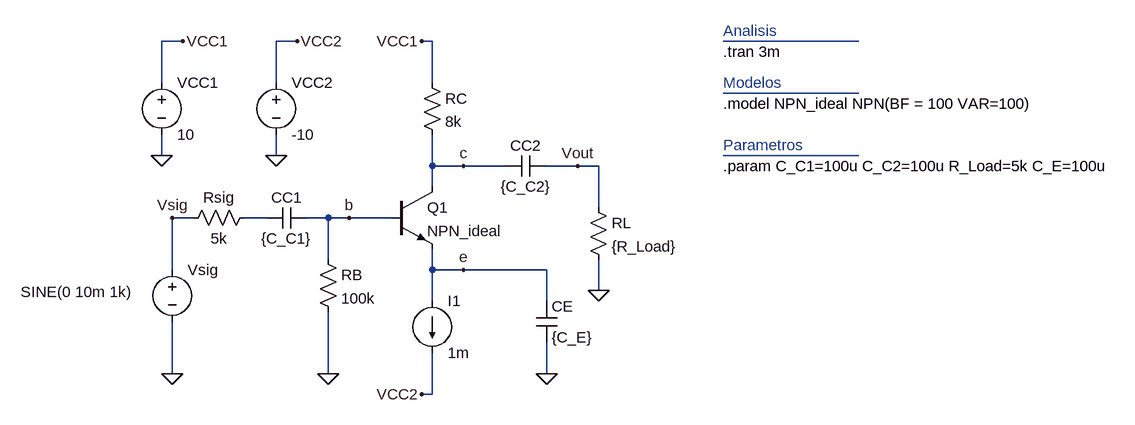
[diagram p0: schematic bjt_ce_time.asc]
bjt_ce_time.asc, the LTspice schematic file:
Version 4
SHEET 1 916 680
WIRE -560 -256 -592 -256
WIRE -384 -256 -416 -256
WIRE -176 -256 -192 -256
WIRE 480 -256 272 -256
WIRE -592 -192 -592 -256
WIRE -416 -192 -416 -256
WIRE -176 -192 -176 -256
WIRE 480 -176 272 -176
WIRE -592 -80 -592 -112
WIRE -416 -80 -416 -112
WIRE 480 -80 272 -80
WIRE -176 -64 -176 -112
WIRE -128 -64 -176 -64
WIRE -64 -64 -128 -64
WIRE 48 -64 0 -64
WIRE 80 -64 48 -64
WIRE -176 -32 -176 -64
WIRE 80 0 80 -64
WIRE -544 16 -576 16
WIRE -432 16 -464 16
WIRE -336 16 -368 16
WIRE -304 16 -336 16
WIRE -240 16 -304 16
WIRE -336 80 -336 16
WIRE -576 96 -576 16
WIRE -176 96 -176 64
WIRE -128 96 -176 96
WIRE 0 96 -128 96
WIRE 80 128 80 80
WIRE -176 144 -176 96
WIRE 0 144 0 96
WIRE -576 256 -576 176
WIRE -336 256 -336 160
WIRE 0 256 0 208
WIRE -176 288 -176 224
WIRE -176 288 -192 288
FLAG -592 -80 0
FLAG -560 -256 VCC1
FLAG -576 256 0
FLAG -192 -256 VCC1
FLAG 48 -64 Vout
FLAG -192 288 VCC2
FLAG 0 256 0
FLAG -336 256 0
FLAG -416 -80 0
FLAG -384 -256 VCC2
FLAG 80 128 0
FLAG -576 16 Vsig
FLAG -304 16 b
FLAG -128 -64 c
FLAG -128 96 e
SYMBOL npn -240 -32 R0
SYMATTR InstName Q1
SYMATTR Value NPN_ideal
SYMBOL res -352 64 R0
SYMATTR InstName RB
SYMATTR Value 100k
SYMBOL res -192 -208 R0
SYMATTR InstName RC
SYMATTR Value 8k
SYMBOL voltage -592 -208 R0
WINDOW 123 0 0 Left 0
WINDOW 39 0 0 Left 0
SYMATTR InstName VCC1
SYMATTR Value 10
SYMBOL voltage -576 80 R0
WINDOW 3 -233 50 Left 2
WINDOW 123 0 0 Left 0
WINDOW 39 0 0 Left 0
SYMATTR Value SINE(0 10m 1k)
SYMATTR InstName Vsig
SYMBOL current -176 144 R0
WINDOW 123 0 0 Left 0
WINDOW 39 0 0 Left 0
SYMATTR InstName I1
SYMATTR Value 1m
SYMBOL cap -368 0 R90
WINDOW 0 0 32 VBottom 2
WINDOW 3 32 32 VTop 2
SYMATTR InstName CC1
SYMATTR Value {C_C1}
SYMBOL cap -16 144 R0
SYMATTR InstName CE
SYMATTR Value {C_E}
SYMBOL cap 0 -80 R90
WINDOW 0 0 32 VBottom 2
WINDOW 3 32 32 VTop 2
SYMATTR InstName CC2
SYMATTR Value {C_C2}
SYMBOL res -448 0 R90
WINDOW 0 0 56 VBottom 2
WINDOW 3 32 56 VTop 2
SYMATTR InstName Rsig
SYMATTR Value 5k
SYMBOL voltage -416 -208 R0
WINDOW 123 0 0 Left 0
WINDOW 39 0 0 Left 0
SYMATTR InstName VCC2
SYMATTR Value -10
SYMBOL res 64 -16 R0
SYMATTR InstName RL
SYMATTR Value {R_Load}
TEXT 272 -240 Left 2 !.tran 3m
TEXT 272 -272 Left 2 ;Analisis
TEXT 272 -160 Left 2 !.model NPN_ideal NPN(BF = 100 VAR=100)
TEXT 272 -192 Left 2 ;Modelos
TEXT 272 -64 Left 2 !.param C_C1=100u C_C2=100u R_Load=5k C_E=100u
TEXT 272 -96 Left 2 ;Parametros

The netlist it stands for:
* bjt_ce_time.asc
Q1 c b e 0 NPN_ideal
RB b 0 100k
RC VCC1 c 8k
VCC1 VCC1 0 10
Vsig Vsig 0 SINE(0 10m 1k)
I1 e VCC2 1m
CC1 b N004 {C_C1}
CE e 0 {C_E}
CC2 Vout c {C_C2}
Rsig N004 Vsig 5k
VCC2 VCC2 0 -10
RL Vout 0 {R_Load}
.model NPN NPN
.model PNP PNP
.lib standard.bjt
.tran 3m
* Analisis
.model NPN_ideal NPN(BF = 100 VAR=100)
* Modelos
.param C_C1=100u C_C2=100u R_Load=5k C_E=100u
* Parametros
.backanno
.end